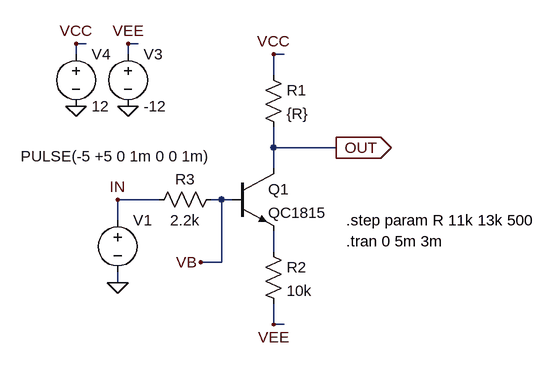
[diagram p0: schematic SAW_TRI_A2_Base_R.asc]
SAW_TRI_A2_Base_R.asc, the LTspice schematic file:
Version 4
SHEET 1 880 680
WIRE -48 -64 -64 -64
WIRE 32 -64 16 -64
WIRE -64 -48 -64 -64
WIRE 16 -48 16 -64
WIRE 256 -48 240 -48
WIRE 240 -16 240 -48
WIRE 240 96 240 64
WIRE 336 96 240 96
WIRE 240 128 240 96
WIRE 64 176 0 176
WIRE 160 176 144 176
WIRE 176 176 160 176
WIRE 0 208 0 176
WIRE 240 256 240 224
WIRE 160 272 160 176
WIRE 160 272 128 272
WIRE 0 304 0 288
WIRE 240 368 240 336
WIRE 256 368 240 368
FLAG 0 304 0
FLAG 0 176 IN
FLAG 240 -48 VCC
FLAG 240 368 VEE
FLAG 336 96 OUT
IOPIN 336 96 Out
FLAG 16 32 0
FLAG -64 32 0
FLAG 16 -64 VEE
FLAG -64 -64 VCC
FLAG 128 272 VB
SYMBOL npn 176 128 R0
SYMATTR InstName Q1
SYMATTR Value QC1815
SYMBOL voltage 0 192 R0
WINDOW 3 -149 -83 Left 2
WINDOW 123 0 0 Left 2
WINDOW 39 0 0 Left 2
SYMATTR Value PULSE(-5 +5 0 1m 0 0 1m)
SYMATTR InstName V1
SYMBOL res 224 -32 R0
SYMATTR InstName R1
SYMATTR Value {R}
SYMBOL res 224 240 R0
SYMATTR InstName R2
SYMATTR Value 10k
SYMBOL voltage 16 -64 R0
WINDOW 123 0 0 Left 2
WINDOW 39 0 0 Left 2
SYMATTR InstName V3
SYMATTR Value -12
SYMBOL voltage -64 -64 R0
WINDOW 123 0 0 Left 2
WINDOW 39 0 0 Left 2
SYMATTR InstName V4
SYMATTR Value 12
SYMBOL res 160 160 R90
WINDOW 0 0 56 VBottom 2
WINDOW 3 32 56 VTop 2
SYMATTR InstName R3
SYMATTR Value 2.2k
TEXT 352 240 Left 2 !.tran 0 5m 3m
TEXT 352 208 Left 2 !.step param R 11k 13k 500

The netlist it stands for:
* SAW_TRI_A2_Base_R.asc
Q1 OUT VB N001 0 QC1815
V1 IN 0 PULSE(-5 +5 0 1m 0 0 1m)
R1 VCC OUT {R}
R2 N001 VEE 10k
V3 VEE 0 -12
V4 VCC 0 12
R3 VB IN 2.2k
.model NPN NPN
.model PNP PNP
.lib standard.bjt
.tran 0 5m 3m
.step param R 11k 13k 500
.backanno
.end